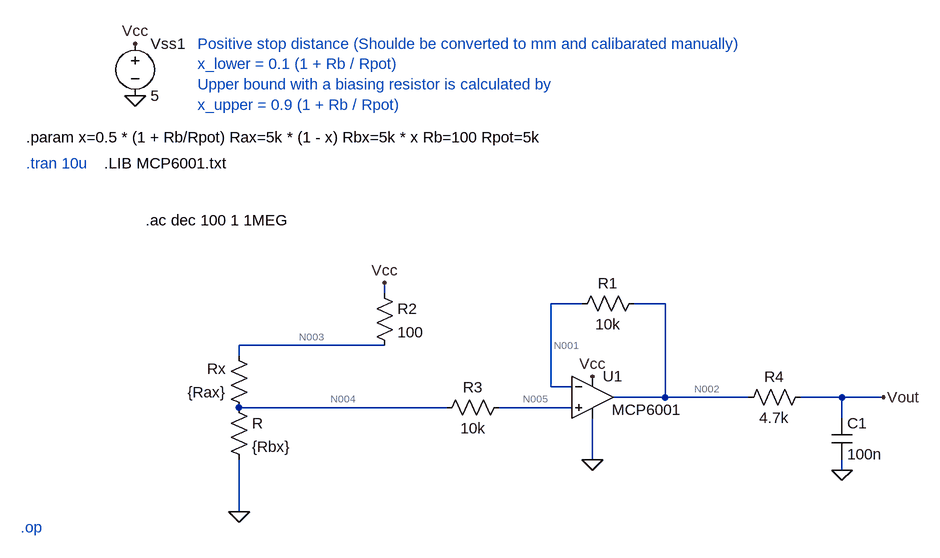
[diagram p0: schematic apps.asc]
apps.asc, the LTspice schematic file:
Version 4.1
SHEET 1 1400 1076
WIRE 560 608 560 592
WIRE 864 624 816 624
WIRE 992 624 944 624
WIRE 560 688 336 688
WIRE 336 704 336 688
WIRE 816 752 816 624
WIRE 848 752 816 752
WIRE 992 768 992 624
WIRE 992 768 912 768
WIRE 1120 768 992 768
WIRE 1264 768 1200 768
WIRE 1328 768 1264 768
WIRE 656 784 336 784
WIRE 848 784 736 784
WIRE 1264 800 1264 768
WIRE 880 864 880 800
WIRE 1264 880 1264 864
WIRE 336 944 336 864
FLAG 336 944 0
FLAG 176 224 Vcc
FLAG 176 304 0
FLAG 880 736 Vcc
FLAG 560 592 Vcc
FLAG 880 864 0
FLAG 1264 880 0
FLAG 1328 768 Vout
SYMBOL res 320 768 R0
SYMATTR InstName R
SYMATTR Value {Rbx}
SYMBOL res 352 800 R180
WINDOW 0 36 76 Left 2
WINDOW 3 36 40 Left 2
SYMATTR InstName Rx
SYMATTR Value {Rax}
SYMBOL voltage 176 208 R0
WINDOW 39 0 0 Left 0
SYMATTR Value2 AC 1
SYMATTR InstName Vss1
SYMATTR Value 5
SYMBOL res 544 592 R0
SYMATTR InstName R2
SYMATTR Value 100
SYMBOL OpAmps\\opamp2 880 704 R0
WINDOW 3 30 83 Left 2
SYMATTR Value MCP6001
SYMATTR InstName U1
SYMBOL res 960 608 R90
WINDOW 0 0 56 VBottom 2
WINDOW 3 32 56 VTop 2
SYMATTR InstName R1
SYMATTR Value 10k
SYMBOL res 1216 752 R90
WINDOW 0 0 56 VBottom 2
WINDOW 3 32 56 VTop 2
SYMATTR InstName R4
SYMATTR Value 4.7k
SYMBOL cap 1248 800 R0
SYMATTR InstName C1
SYMATTR Value 100n
SYMBOL res 752 768 R90
WINDOW 0 0 56 VBottom 2
WINDOW 3 32 56 VTop 2
SYMATTR InstName R3
SYMATTR Value 10k
TEXT 8 408 Left 2 ;.tran 10u
TEXT 8 368 Left 2 !.param x=0.5 * (1 + Rb/Rpot) Rax=5k * (1 - x) Rbx=5k * x Rb=100 Rpot=5k
TEXT 272 224 Left 2 ;Positive stop distance (Shoulde be converted to mm and calibarated manually)\nx_lower = 0.1 (1 + Rb / Rpot) \nUpper bound with a biasing resistor is calculated by\nx_upper = 0.9 (1 + Rb / Rpot)
TEXT 128 408 Left 2 !.LIB MCP6001.txt
TEXT 192 496 Left 2 !.ac dec 100 1 1MEG
TEXT 0 968 Left 2 ;.op

The netlist it stands for:
* apps.asc
R N004 0 {Rbx}
Rx N004 N003 {Rax}
Vss1 Vcc 0 5 AC 1
R2 Vcc N003 100
X§U1 N005 N001 Vcc 0 N002 MCP6001  ; pins In+ In- V+ V- OUT
R1 N002 N001 10k
R4 Vout N002 4.7k
C1 Vout 0 100n
R3 N005 N004 10k
* .tran 10u
.param x=0.5 * (1 + Rb/Rpot) Rax=5k * (1 - x) Rbx=5k * x Rb=100 Rpot=5k
* Positive stop distance (Shoulde be converted to mm and calibarated manually)
* x_lower = 0.1 (1 + Rb / Rpot)
* Upper bound with a biasing resistor is calculated by
* x_upper = 0.9 (1 + Rb / Rpot)
.LIB MCP6001.txt
.ac dec 100 1 1MEG
* .op
.backanno
.end

* Results of the author's LTspice run, read from the files saved beside the schematic
* Operating Point, zero values left out:
*   V(n001) = 2.499 V
*   V(n002) = 2.499 V
*   V(n003) = 4.902 V
*   V(n004) = 2.5 V
*   V(n005) = 2.5 V
*   V(vcc) = 5 V
*   V(vout) = 2.499 V
*   I(R) = 980.4 µA
*   I(R2) = 980.4 µA
*   I(Rx) = -980.4 µA
*   I(Vss1) = -1.091 mA
*   Ix(u1:3) = 110.5 µA
*   Ix(u1:4) = -110.5 µA
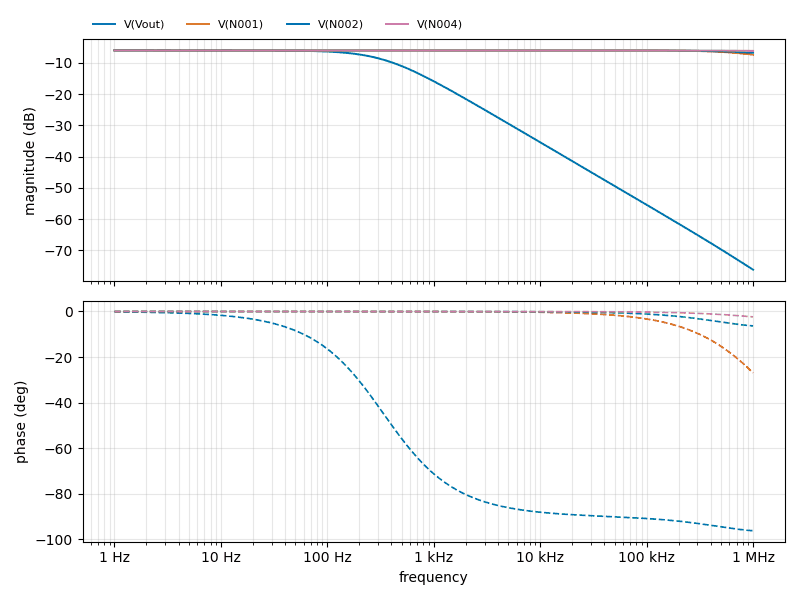
[diagram p1: AC Analysis of apps.asc, plotted from the saved traces]
* AC Analysis, 1 run:
*   V(Vout): -6.02 dB at 1 Hz, -76.21 dB at 1 MHz, peak -6.02 dB at 1 Hz, 3 dB below the peak at 338.6 Hz
*   V(N001): -6.02 dB at 1 Hz, -7.38 dB at 1 MHz, peak -6.02 dB at 2.188 kHz
*   V(N002): -6.02 dB at 1 Hz, -6.81 dB at 1 MHz, peak -6.02 dB at 2.344 kHz
*   V(N004): -6.02 dB at 1 Hz, -6.16 dB at 1 MHz, peak -6.02 dB at 1 Hz